# Altium schematic sheet ESP8266Watch-dev-Sch.schdoc
size 178 x 88 mm
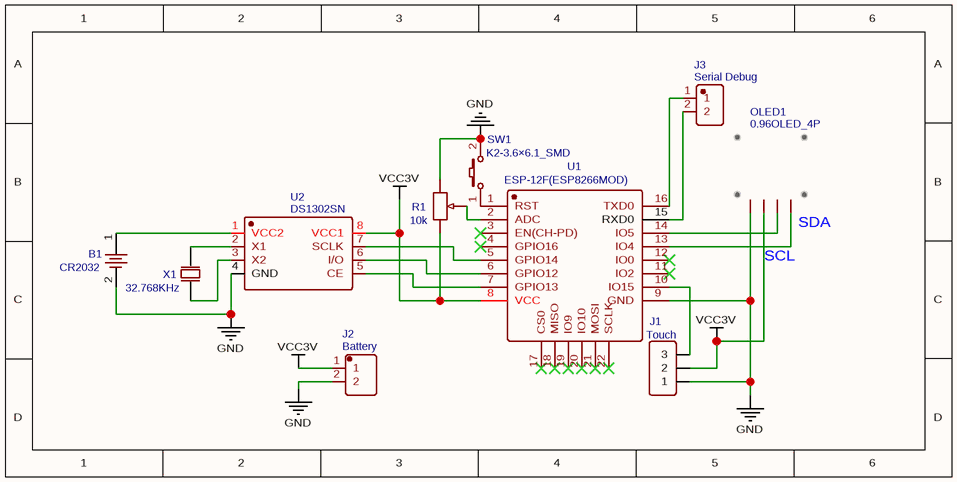
[diagram p0: ESP8266Watch-dev-Sch.schdoc]

## Parts
B1  CR2032  [BAT-TH_BS-2-1]
J1  Touch  [HDR-TH_3P-P2.54-V-F]
J2  Battery  [1.25T-1-2A]
J3  Serial Debug  [HDR-TH_2P-P2.00-V-M]
OLED1  0.96OLED_4P  [0.96OLED_4P]
R1  10k  [RES-ADJ-TH_3386P]
SW1  K2-3.6×6.1_SMD  [KEY-SMD_2P-L6.2-W3.6-LS8.0]
U1  ESP-12F(ESP8266MOD)  [WIFIM-SMD_ESP-12F-ESP8266MOD]
U2  DS1302SN  [SOIC-8_L5.3-W5.3-P1.27-LS8.0-BL]
X1  32.768KHz  [OSC-TH_BD2.0-P0.70-D0.3]

## Nets
GND: B1.2 J1.1 J2.2 OLED1.1 R1.1 SW1.2 U1.9(GND) U2.4(GND)
VCC3V: J1.2 J2.1 OLED1.2 R1.3 U1.8(VCC) U2.8(VCC1)
NetB1_1: B1.1 U2.1(VCC2)
NetJ1_3: J1.3 U1.10(IO15)
NetJ3_1: J3.1 U1.16(TXD0)
NetJ3_2: J3.2 U1.15(RXD0)
NetOLED1_3: OLED1.3 U1.14(IO5)
NetOLED1_4: OLED1.4 U1.13(IO4)
NetR1_2: R1.2 U1.2(ADC)
NetSW1_1: SW1.1 U1.1(RST)
NetU1_5: U1.5(GPIO14) U2.7(SCLK)
NetU1_6: U1.6(GPIO12) U2.6(I/O)
NetU1_7: U1.7(GPIO13) U2.5(CE)
NetU2_2: U2.2(X1) X1.2(OSC2)
NetU2_3: U2.3(X2) X1.1(OSC1)

Not connected (* = marked no-connect by the designer): U1 3(EN(CH-PD))* 4(GPIO16)* 11(IO2)* 12(IO0)* 17(CS0)* 18(MISO)* 19(IO9)* 20(IO10)* 21(MOSI)* 22(SCLK)*

## Notes on the sheet
- (near OLED1) SDA
- (near OLED1) SCL
- (in symbol 0.96OLED_4P) Hello World!!!

## Library data of the parts
B1 = CR2032: BOM_Manufacturer: Q&J; BOM_Manufacturer Part: BS-2-1; BOM_Supplier: LCSC; BOM_Supplier Part: C70376; BOM_JLCPCB Part Class: Extended Part; spicePre: B; spiceSymbolName: CR2032-BS-2-1
J1 = Touch: BOM_Manufacturer: Boom Precision Elec; BOM_Manufacturer Part: Header-Female-2.54_1x3; BOM_Supplier Part: C146243; BOM_Supplier: LCSC; link: https://datasheet.lcsc.com/szlcsc/Boom-Precision-Elec-2-54mm-1-8P-Straight-Female-header_C27438.pdf; BOM_JLCPCB Part Class: Extended Part; spicePre: P; spiceSymbolName: Header-Female-2.54_1x3
J2 = Battery: BOM_Manufacturer: ReliaPro; BOM_Supplier Part: C2324; BOM_Supplier: LCSC; BOM_Manufacturer Part: 1.25T-1-2A; spicePre: J; spiceSymbolName: 1.25T-1-2A_C2324
J3 = Serial Debug: BOM_Manufacturer: CJT(长江连接器); BOM_Manufacturer Part: A2005WV-2P; Contributor: LCSC; BOM_Supplier: LCSC; BOM_Supplier Part: C2879963; spicePre: H; spiceSymbolName: A2005WV-2P_C2879963
OLED1 = 0.96OLED_4P: Contributor: LCEDA_Lib; BOM_Supplier: LCSC; spicePre: O; spiceSymbolName: 0.96OLED_4P
R1 = 10k: nameAlias: Resistance (Ohms); Contributor: LCEDA_Lib; Package Display: No; BOM_Supplier: LCSC; Value(Ω): 10K; spicePre: R; spiceSymbolName: R_3386P_EU
SW1 = K2-3.6×6.1_SMD: BOM_Manufacturer Part: K2-1107ST-A4SW-06; Contributor: LCEDA_Lib; 制造商: 韩国韩荣; BOM_Supplier Part: C118141; BOM_Supplier: LCSC; spicePre: K; spiceSymbolName: K2-3.6×6.1_SMD
U1 = ESP-12F(ESP8266MOD): BOM_Manufacturer: Ai-Thinker; BOM_Supplier: LCSC; BOM_Manufacturer Part: ESP-12F(ESP8266MOD); BOM_Supplier Part: C82891; BOM_JLCPCB Part Class: Extended Part; spicePre: U; spiceSymbolName: ESP-12F(ESP8266MOD)
U2 = DS1302SN: BOM_Manufacturer: MAXIM; BOM_Manufacturer Part: DS1302SN+T&R; BOM_Supplier: LCSC; BOM_Supplier Part: C41719; BOM_JLCPCB Part Class: Extended Part; spicePre: U; spiceSymbolName: DS1302SN+T&amp;amp;R
X1 = 32.768KHz: BOM_Manufacturer: CITIZEN; BOM_Manufacturer Part: CFS-20632768DZFB; nameAlias: Frequency; Contributor: LCSC; BOM_Supplier: LCSC; BOM_Supplier Part: C100098; BOM_JLCPCB Part Class: Extended Part; spicePre: X; spiceSymbolName: CFS-20632768DZFB